# Altium schematic sheet Spanungsversorgung.SchDoc: SysP18_Team10: Spannungsregler
size A4; CheckedBy: Kyburz Falk; Author: Michael Alig; CompanyName: NTB; Organization: NTB Interstate University of Applied; Address1: Werdenbergstrasse 4; Address3: 9471 Buchs; Address4: Switzerland; Revision: 14.03.2018; SheetNumber: 2; SheetTotal: 5; Organization1: Sciences of Technology Buchs; Size: A4; ShortDescription: Schema Spannungsregler 3.3V, 5V, 12V
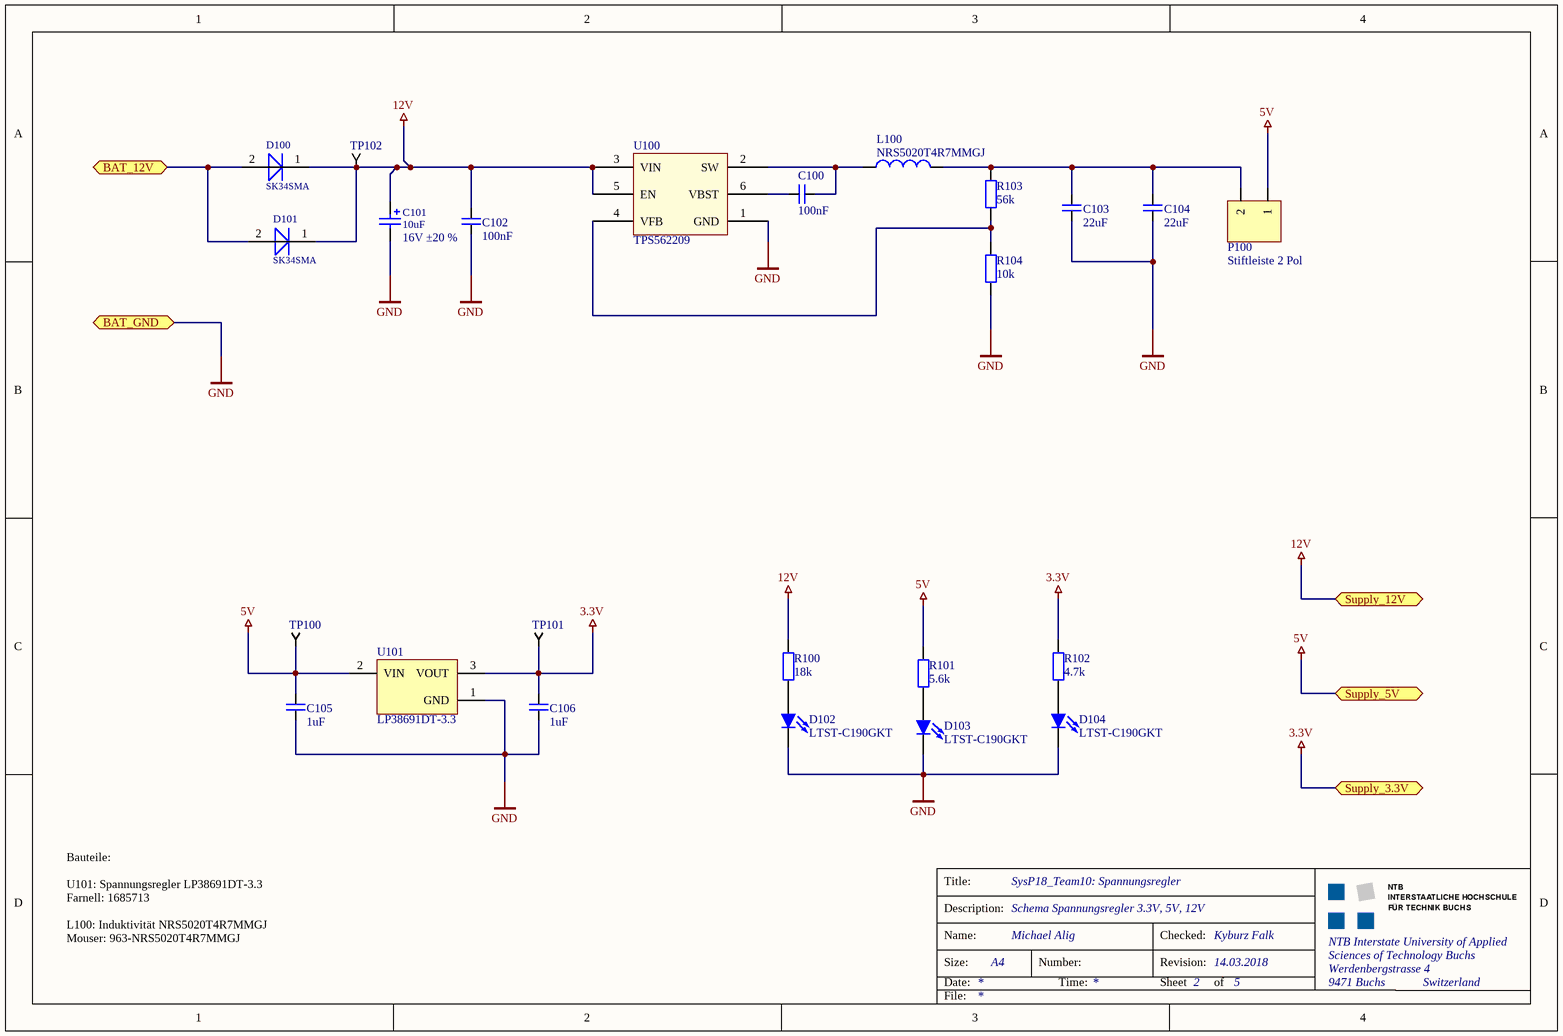
[diagram p0: Spanungsversorgung.SchDoc]

## Parts
C100  100nF  [CAPC0805]
C101  value 10uF  ValueAddon: 16V ±20 %  [CDE_CAP AVE CODE D_H]  (hidden comment: AVE476M16D16T-F)
C102  100nF  [CAPC0805]
C103  22uF  [CAPC1206]
C104  22uF  [CAPC1206]
C105  1uF  [CAPC0805]
C106  1uF  [CAPC0805]
D100  SK34SMA  [DIOTEC_DO-214AC_1K2A_2_H]
D101  SK34SMA  [DIOTEC_DO-214AC_1K2A_2_H]
D102  LTST-C190GKT  [LED 0603 green]
D103  LTST-C190GKT  [LED 0603 green]
D104  LTST-C190GKT  [LED 0603 green]
L100  NRS5020T4R7MMGJ  [NRS5024T4R7MMGJV]
P100  Stiftleiste 2 Pol  [2Pin Header 2.54mm]
R100  value 18k  [GEN_R0805_H]  (hidden comment: Generic)
R101  value 5.6k  [GEN_R0805_H]  (hidden comment: Generic)
R102  value 4.7k  [GEN_R0805_H]  (hidden comment: Generic)
R103  value 56k  [GEN_R0805_H]  (hidden comment: Generic)
R104  value 10k  [GEN_R0805_H]  (hidden comment: Generic)
TP100  Testpoint xSmall  [TP_SMD_xsmall]  (value not drawn)  (no BOM)
TP101  Testpoint xSmall  [TP_SMD_xsmall]  (value not drawn)  (no BOM)
TP102  Testpoint xSmall  [TP_SMD_xsmall]  (value not drawn)  (no BOM)
U100  TPS562209  [SOT23-6]
U101  LP38691DT-3.3  [TO-92-TO3]

## Ports
BAT_12V, BAT_GND, Supply_3.3V, Supply_5V, Supply_12V

## Nets
3.3V: C106.1 R102.2 TP101.1 U101.3(VOUT) ; port Supply_3.3V
5V: C105.1 P100.1 R101.2 TP100.1 U101.2(VIN) ; port Supply_5V
12V: C101.1(Pos) C102.1 D100.1(K) D101.1(K) R100.2 TP102.1 U100.3(VIN) U100.5(EN) ; port Supply_12V
GND: C101.2(Neg) C102.2 C103.1 C104.2 C105.2 C106.2 D102.1(K) D103.1(K) D104.1(K) R104.1 U100.1(GND) U101.1(GND) ; port BAT_GND
BAT_12V: D100.2(A) D101.2(A) ; port BAT_12V
NetC100_1: C100.1 U100.6(VBST)
NetC100_2: C100.2 L100.1 U100.2(SW)
NetC103_2: C103.2 C104.1 L100.2 P100.2 R103.2
NetD102_2: D102.2(A) R100.1
NetD103_2: D103.2(A) R101.1
NetD104_2: D104.2(A) R102.1
NetR103_1: R103.1 R104.2 U100.4(VFB)

## Notes on the sheet
- Bauteile:
  U101: Spannungsregler LP38691DT-3.3
  Farnell: 1685713
  L100: Induktivität NRS5020T4R7MMGJ
  Mouser: 963-NRS5020T4R7MMGJ
- Title:
- Description:
- Size:
- Date:
- Name:
- Number:
- Time:
- Revision:
- Sheet
- Checked:
- of
- File:

## Library data of the parts
C100 C102 C105 C106 = C Bipolar 0805: X7R MLCC 0805 (2012 Metric); Rated Voltage: 50V; Value: 100n; Tolerance: 10%; Case-EIA: 0805; Case-Metric: 2012; Temperature Characteristics EIA: X7R; Temperature Range EIA: -55C/+125C
C101 = CDE_AVE476M16D16T-F_AVE CODE D: Aluminum Electrolytic Capacitors for Filtering and Bypass, 47uF, 16V; Manufacturer: Cornell Dubilier; #Class: PASSIVE; RefFootprint: CDE_CAP AVE CODE D; #ClassSub: CAPACITOR; Distributor PartNr: 598-AVE476M16D16T-F; Distributor: Mouser; Published: 20121220; Publisher: Stefan Ursella, M.Eng; ComponentLink1Description: Manufacturer Link; ComponentLink2Description: Datasheet; ComponentLink2URL: http://www.cde.com/catalogs/AVE.pdf; ComponentLink3Description: Packaging Specification; Manufacturer PartNr: AVE476M16D16T-F; RefFileFOO: *; RefFileSCH: *; RefSchema: CDE_AVE476M16D16T-F_AVE CODE D
C103 C104 = C Bipolar 1206: X7R MLCC 1206 (3016 Metric); Rated Voltage: 10V; Value: 22u; Tolerance: 10%; Case-EIA: 1206; Case-Metric: 3216; Temperature Characteristics EIA: X7R; Temperature Range EIA: -55C/+125C
D100 D101 = DIOTEC_SK34SMA_DO-214AC: Manufacturer: Diotec Semiconductor; #Class: DIODE; #ClassSub: SCHOTTKY; ComponentLink1Description: Manufacturer Link; ComponentLink1URL: http://diotec.com/en/products/all-products/productlist.html?aid=SK34SMA; ComponentLink2Description: Datasheet; ComponentLink2URL: http://diotec.com/tl_files/diotec/files/pdf/datasheets/sk32sma.pdf; ComponentLink3Description: Packaging Specification; ComponentLink3URL: http://diotec.com/en/products/all-products/productlist.html?aid=SK34SMA; Distributor: Distrelec; RefFootprint: DIOTEC_DO-214AC_1K2A_2_H; Manufacturer PartNr: SK34SMA; Distributor PartNr: 600727; Published: 20121217; Publisher: Stefan Ursella, M.Eng; Status: nLager; RefFileFOO: *; RefFileSCH: *; RefSchema: DIOTEC_SK34SMA_DO-214AC
D102-D104 = LED: LED SMD 0603 green 6mcd; Forward Current: 30mA; Forward Voltage: 2.1V; Spectrum: 565nm; Color: green; ComponentLink1Description: Datasheet LTST-C190GKT; ComponentLink1URL: V:\Diodes\Lite-On-LTST-C190GKT.pdf
L100 = NRS5020T4R7MMGJ: Tayo Yuden NRS5020T4R7MMGJ 4u7 2A
P100 = 2 Pin Connector
R100-R104 = GEN_R_2: generic resistor; Manufacturer: Tbd; #Class: PASSIVE; Published: 8-Jun-2000; Publisher: Altium Limited; #ClassSub: RESISTOR; ComponentLink1Description: Manufacturer Link; ComponentLink2Description: Datasheet; ComponentLink3Description: Packaging Specification; Distributor: tbd; RefFootprint: GEN_R0805_H; Manufacturer PartNr: tbd; Distributor PartNr: tbd; RefFileFOO: *; RefFileSCH: *; RefSchema: GEN_R_2
TP100-TP102 = Testpoint small: Type: Standard (No BOM)
U100 = TPS562209: 3-A Synchronous Step-Down Voltage Regulator; Manufactor: Texas Instruments; Order Nr.: TPS562209DDCR; ComponentLink1Description: Datasheet TPS56x209; ComponentLink1URL: V:\Power_Management_ICs\PWM_Cont\TPS56x209.pdf
U101 = MCP1700-1202E/TO: Low Quiescent Current LDO, 3-Pin TO-92, Extended TemperatureBAG; Published: 29-Jan-2009; DatasheetVersion: revB, Feb-2007; PackageVersion: revBB, Aug-2009; PackageReference: TO-92-TO3; Publisher: Altium Limited; PackageDescription: 3-Lead Plastic Transistor Outline (TO) [TO-92]; Supplier 1: Digi-Key; Supplier Part Number 1: MCP1700-1202E/TO-ND; ComponentLink1Description: Datasheet; ComponentLink1URL: http://ww1.microchip.com/downloads/en/DeviceDoc/21826b.pdf; ComponentLink2Description: Packaging Specification; ComponentLink2URL: http://www.microchip.com/stellent/groups/techpub_sg/documents/packagingspec/en012702.pdf; ComponentLink3Description: Microchip.com Home; ComponentLink3URL: http://www.microchip.com/